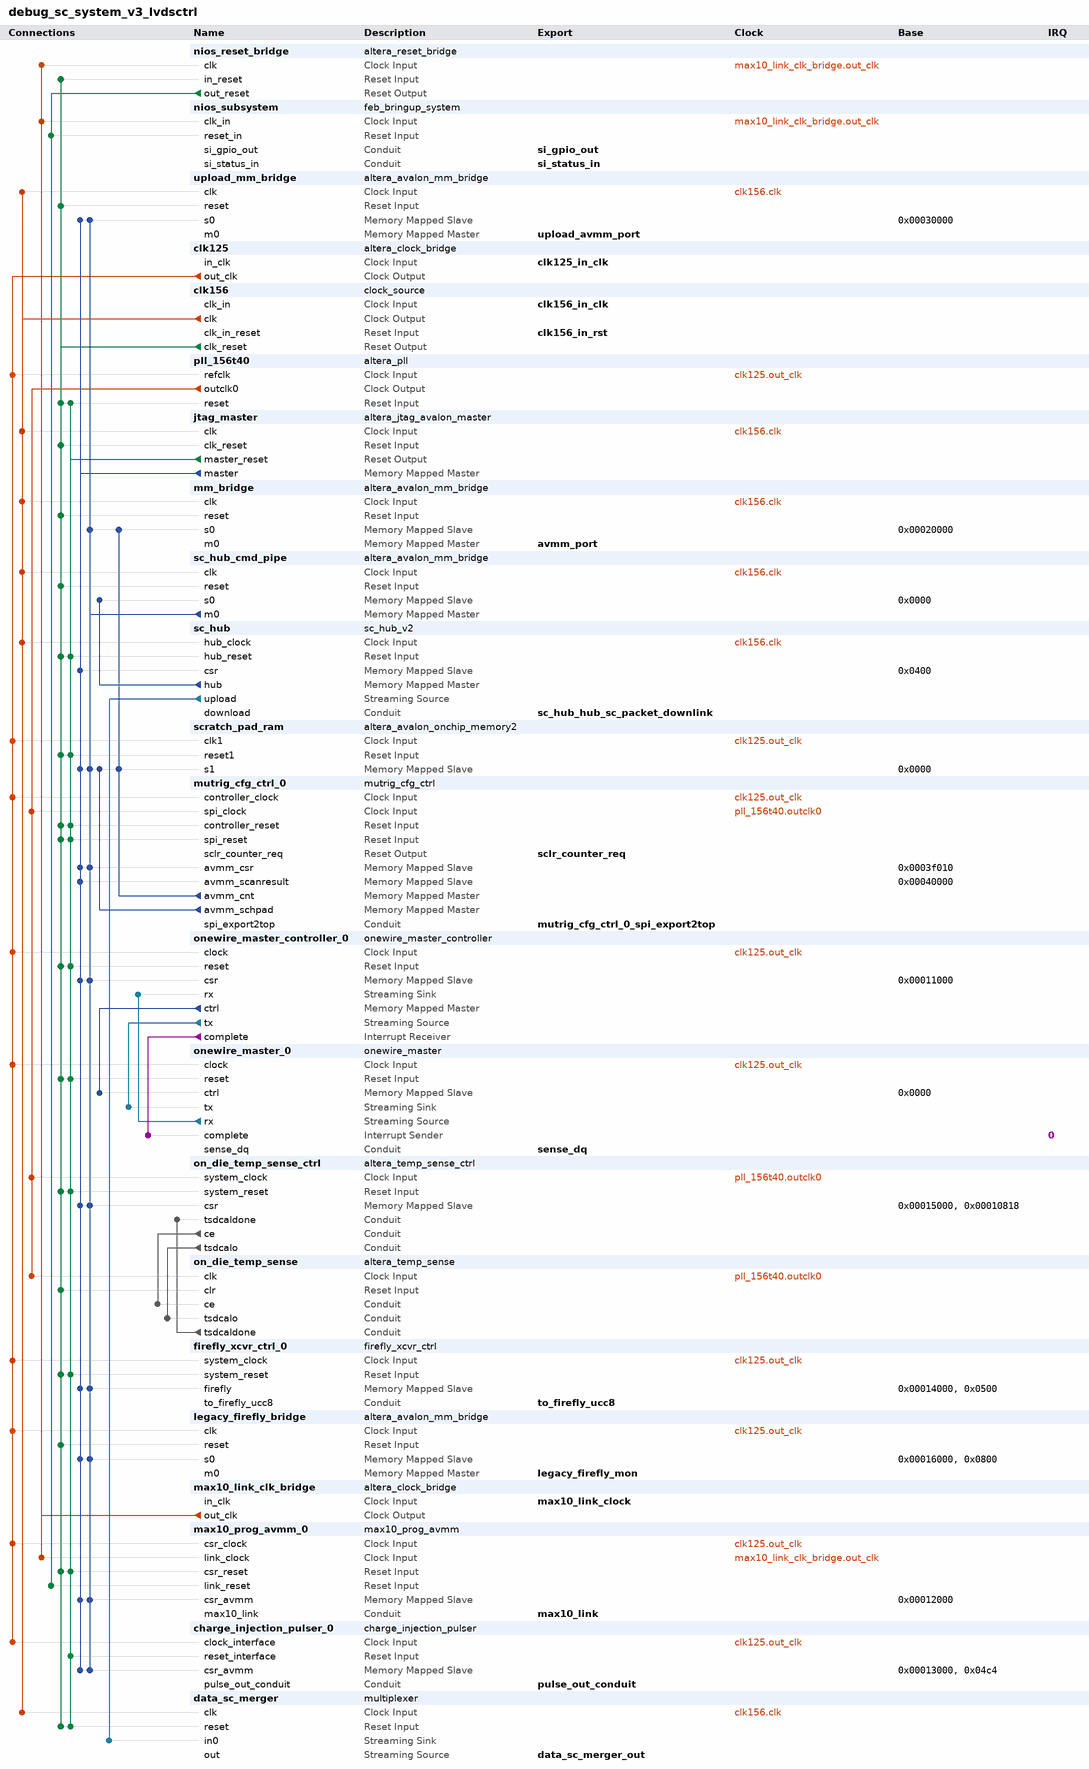
[diagram p0: system contents]
# Platform Designer (Qsys) system debug_sc_system_v3_lvdsctrl, Arria V 5AGXBA7D4F31C5
# Parameters at their usual value, and those the tool derives, are not listed.
package require -exact qsys 18.1
create_system debug_sc_system_v3_lvdsctrl
set_project_property DEVICE_FAMILY {Arria V}
set_project_property DEVICE 5AGXBA7D4F31C5

add_instance nios_reset_bridge altera_reset_bridge 18.1
set_instance_parameter_value nios_reset_bridge ACTIVE_LOW_RESET 0
set_instance_parameter_value nios_reset_bridge SYNCHRONOUS_EDGES deassert

add_instance nios_subsystem feb_bringup_system 1.0

add_instance upload_mm_bridge altera_avalon_mm_bridge 18.1
set_instance_parameter_value upload_mm_bridge ADDRESS_UNITS WORDS
set_instance_parameter_value upload_mm_bridge ADDRESS_WIDTH 5
set_instance_parameter_value upload_mm_bridge DATA_WIDTH 32
set_instance_parameter_value upload_mm_bridge MAX_PENDING_RESPONSES 4
set_instance_parameter_value upload_mm_bridge PIPELINE_COMMAND 0
set_instance_parameter_value upload_mm_bridge USE_AUTO_ADDRESS_WIDTH 0
set_instance_parameter_value upload_mm_bridge USE_RESPONSE 1

add_instance clk125 altera_clock_bridge 18.1
set_instance_parameter_value clk125 DERIVED_CLOCK_RATE 0
set_instance_parameter_value clk125 EXPLICIT_CLOCK_RATE 125000000

add_instance clk156 clock_source 18.1
set_instance_parameter_value clk156 clockFrequency 156250000
set_instance_parameter_value clk156 resetSynchronousEdges DEASSERT

add_instance pll_156t40 altera_pll 18.1
set_instance_parameter_value pll_156t40 gui_device_speed_grade 1
set_instance_parameter_value pll_156t40 gui_number_of_clocks 1
set_instance_parameter_value pll_156t40 gui_operation_mode direct
set_instance_parameter_value pll_156t40 gui_output_clock_frequency0 40.0
set_instance_parameter_value pll_156t40 gui_pll_mode {Integer-N PLL}
set_instance_parameter_value pll_156t40 gui_reference_clock_frequency 125.0
set_instance_parameter_value pll_156t40 gui_use_locked true

add_instance jtag_master altera_jtag_avalon_master 18.1
set_instance_parameter_value jtag_master FAST_VER 1

add_instance mm_bridge altera_avalon_mm_bridge 18.1
set_instance_parameter_value mm_bridge ADDRESS_UNITS WORDS
set_instance_parameter_value mm_bridge ADDRESS_WIDTH 14
set_instance_parameter_value mm_bridge DATA_WIDTH 32
set_instance_parameter_value mm_bridge MAX_PENDING_RESPONSES 1
set_instance_parameter_value mm_bridge USE_AUTO_ADDRESS_WIDTH 1
set_instance_parameter_value mm_bridge USE_RESPONSE 1

add_instance sc_hub_cmd_pipe altera_avalon_mm_bridge 18.1
set_instance_parameter_value sc_hub_cmd_pipe ADDRESS_UNITS WORDS
set_instance_parameter_value sc_hub_cmd_pipe ADDRESS_WIDTH 18
set_instance_parameter_value sc_hub_cmd_pipe DATA_WIDTH 32
set_instance_parameter_value sc_hub_cmd_pipe MAX_PENDING_RESPONSES 1
set_instance_parameter_value sc_hub_cmd_pipe PIPELINE_COMMAND 0
set_instance_parameter_value sc_hub_cmd_pipe PIPELINE_RESPONSE 0
set_instance_parameter_value sc_hub_cmd_pipe USE_AUTO_ADDRESS_WIDTH 1
set_instance_parameter_value sc_hub_cmd_pipe USE_RESPONSE 1

add_instance sc_hub sc_hub_v2 26.6.10.423
set_instance_parameter_value sc_hub ADDR_WIDTH 18
set_instance_parameter_value sc_hub ATOMIC_ENABLE true
set_instance_parameter_value sc_hub AXI4_ID_WIDTH 4
set_instance_parameter_value sc_hub AXI4_USER_WIDTH 16
set_instance_parameter_value sc_hub BACKPRESSURE true
set_instance_parameter_value sc_hub BP_FIFO_DEPTH 512
set_instance_parameter_value sc_hub BUILD 414
set_instance_parameter_value sc_hub BUS_TYPE AVALON
set_instance_parameter_value sc_hub DATA_WIDTH 32
set_instance_parameter_value sc_hub DEBUG 1
set_instance_parameter_value sc_hub EXT_DOWN_PLD_DEPTH 512
set_instance_parameter_value sc_hub EXT_UP_PLD_DEPTH 512
set_instance_parameter_value sc_hub GIT_STAMP_OVERRIDE false
set_instance_parameter_value sc_hub HUB_CAP_ENABLE true
set_instance_parameter_value sc_hub INSTANCE_ID 0
set_instance_parameter_value sc_hub INT_DOWN_PLD_DEPTH 64
set_instance_parameter_value sc_hub INT_HDR_DEPTH 4
set_instance_parameter_value sc_hub INT_UP_PLD_DEPTH 64
set_instance_parameter_value sc_hub INVERT_RD_SIG false
set_instance_parameter_value sc_hub IP_UID 1396918338
set_instance_parameter_value sc_hub MAX_BURST 256
set_instance_parameter_value sc_hub OOO_ENABLE false
set_instance_parameter_value sc_hub ORD_ENABLE true
set_instance_parameter_value sc_hub ORD_NUM_DOMAINS 16
set_instance_parameter_value sc_hub OUTSTANDING_INT_RESERVED 2
set_instance_parameter_value sc_hub OUTSTANDING_LIMIT 8
set_instance_parameter_value sc_hub PRESET FEB_SCIFI_DEFAULT
set_instance_parameter_value sc_hub RD_TIMEOUT_CYCLES 1024
set_instance_parameter_value sc_hub SCHEDULER_USE_PKT_TRANSFER true
set_instance_parameter_value sc_hub S_AND_F_ENABLE true
set_instance_parameter_value sc_hub VERSION_DATE 20260414
set_instance_parameter_value sc_hub VERSION_GIT 98822845
set_instance_parameter_value sc_hub VERSION_MAJOR 26
set_instance_parameter_value sc_hub VERSION_MINOR 6
set_instance_parameter_value sc_hub VERSION_PATCH 9
set_instance_parameter_value sc_hub WR_TIMEOUT_CYCLES 1024

add_instance scratch_pad_ram altera_avalon_onchip_memory2 18.1
set_instance_parameter_value scratch_pad_ram allowInSystemMemoryContentEditor true
set_instance_parameter_value scratch_pad_ram blockType M10K
set_instance_parameter_value scratch_pad_ram dataWidth 32
set_instance_parameter_value scratch_pad_ram dualPort false
set_instance_parameter_value scratch_pad_ram initMemContent true
set_instance_parameter_value scratch_pad_ram initializationFileName onchip_mem.hex
set_instance_parameter_value scratch_pad_ram instanceID 1
set_instance_parameter_value scratch_pad_ram memorySize 1024

add_instance mutrig_cfg_ctrl_0 mutrig_cfg_ctrl 24.1.423
set_instance_parameter_value mutrig_cfg_ctrl_0 CLK_FREQUENCY 125000000
set_instance_parameter_value mutrig_cfg_ctrl_0 CLK_FREQUENCY_SPI 40000000
set_instance_parameter_value mutrig_cfg_ctrl_0 COUNTER_MM_ADDR_OFFSET_WORD 32768
set_instance_parameter_value mutrig_cfg_ctrl_0 CPHA 0
set_instance_parameter_value mutrig_cfg_ctrl_0 CPOL 0
set_instance_parameter_value mutrig_cfg_ctrl_0 DEBUG 1
set_instance_parameter_value mutrig_cfg_ctrl_0 INTENDED_MUTRIG_VERSION {MuTRiG 3}
set_instance_parameter_value mutrig_cfg_ctrl_0 N_MUTRIG 4
set_instance_parameter_value mutrig_cfg_ctrl_0 SEL_SUBROUTINES 2

add_instance onewire_master_controller_0 onewire_master_controller 24.1.423
set_instance_parameter_value onewire_master_controller_0 AVMM_DATA_WIDTH 32
set_instance_parameter_value onewire_master_controller_0 AVST_CHANNEL_WIDTH 3
set_instance_parameter_value onewire_master_controller_0 AVST_DATA_WIDTH 8
set_instance_parameter_value onewire_master_controller_0 DEBUG_LV 0
set_instance_parameter_value onewire_master_controller_0 N_DQ_LINES 6
set_instance_parameter_value onewire_master_controller_0 REF_CLOCK_RATE 125000000
set_instance_parameter_value onewire_master_controller_0 SENSOR_TYPE DS18B20

add_instance onewire_master_0 onewire_master 24.1.423
set_instance_parameter_value onewire_master_0 AVMM_DATA_WIDTH 32
set_instance_parameter_value onewire_master_0 AVST_CHANNEL_WIDTH 3
set_instance_parameter_value onewire_master_0 AVST_DATA_WIDTH 8
set_instance_parameter_value onewire_master_0 DEBUG_LV 0
set_instance_parameter_value onewire_master_0 EN_STREAMING true
set_instance_parameter_value onewire_master_0 MASTER_INIT_RESET_US 500
set_instance_parameter_value onewire_master_0 MASTER_SAMPLE_PRESENCE_TIMEOUT_US 1000
set_instance_parameter_value onewire_master_0 MASTER_WAIT_PRESENCE_US 45
set_instance_parameter_value onewire_master_0 N_DQ_LINES 6
set_instance_parameter_value onewire_master_0 PARACITIC_POWERING false
set_instance_parameter_value onewire_master_0 REF_CLOCK_RATE 125000000
set_instance_parameter_value onewire_master_0 RX_BUFFER_DEPTH 16
set_instance_parameter_value onewire_master_0 RX_MASTER_SAMPLE_US 10
set_instance_parameter_value onewire_master_0 RX_PULL_LOW_US 5
set_instance_parameter_value onewire_master_0 RX_SLOT_US 90
set_instance_parameter_value onewire_master_0 SLOTS_SEPERATION_US 5
set_instance_parameter_value onewire_master_0 TX_BUFFER_DEPTH 8
set_instance_parameter_value onewire_master_0 TX_PULL_LOW_US 5
set_instance_parameter_value onewire_master_0 TX_SLOT_US 90
set_instance_parameter_value onewire_master_0 USE_IRQ true
set_instance_parameter_value onewire_master_0 VARIANT lite

add_instance on_die_temp_sense_ctrl altera_temp_sense_ctrl 1.1
set_instance_parameter_value on_die_temp_sense_ctrl CLK_FREQ 40000000
set_instance_parameter_value on_die_temp_sense_ctrl DEBUG 0

add_instance on_die_temp_sense altera_temp_sense 18.1
set_instance_parameter_value on_die_temp_sense CBX_AUTO_BLACKBOX ALL
set_instance_parameter_value on_die_temp_sense CE_CHECK true
set_instance_parameter_value on_die_temp_sense CLK_FREQUENCY 40.0
set_instance_parameter_value on_die_temp_sense CLOCK_DIVIDER_VALUE 80
set_instance_parameter_value on_die_temp_sense CLR_CHECK true
set_instance_parameter_value on_die_temp_sense NUMBER_OF_SAMPLES 128
set_instance_parameter_value on_die_temp_sense POI_CAL_TEMPERATURE 85
set_instance_parameter_value on_die_temp_sense SIM_TSDCALO 0
set_instance_parameter_value on_die_temp_sense USER_OFFSET_ENABLE off
set_instance_parameter_value on_die_temp_sense USE_WYS on

add_instance firefly_xcvr_ctrl_0 firefly_xcvr_ctrl 26.2.423
set_instance_parameter_value firefly_xcvr_ctrl_0 AVS_FIREFLY_ADDR_W 5
set_instance_parameter_value firefly_xcvr_ctrl_0 DEBUG 1
set_instance_parameter_value firefly_xcvr_ctrl_0 I2C_BAUD_RATE 400000
set_instance_parameter_value firefly_xcvr_ctrl_0 SYSTEM_CLK_FREQ 125000000

add_instance legacy_firefly_bridge altera_avalon_mm_bridge 18.1
set_instance_parameter_value legacy_firefly_bridge ADDRESS_UNITS WORDS
set_instance_parameter_value legacy_firefly_bridge ADDRESS_WIDTH 8
set_instance_parameter_value legacy_firefly_bridge DATA_WIDTH 32
set_instance_parameter_value legacy_firefly_bridge MAX_PENDING_RESPONSES 1
set_instance_parameter_value legacy_firefly_bridge PIPELINE_RESPONSE 0
set_instance_parameter_value legacy_firefly_bridge USE_AUTO_ADDRESS_WIDTH 0
set_instance_parameter_value legacy_firefly_bridge USE_RESPONSE 1

add_instance max10_link_clk_bridge altera_clock_bridge 18.1
set_instance_parameter_value max10_link_clk_bridge DERIVED_CLOCK_RATE 0
set_instance_parameter_value max10_link_clk_bridge EXPLICIT_CLOCK_RATE 50000000

add_instance max10_prog_avmm_0 max10_prog_avmm 0.2.0
set_instance_parameter_value max10_prog_avmm_0 BOOT_HIST_AUTO_REFRESH 1
set_instance_parameter_value max10_prog_avmm_0 BUILD 0
set_instance_parameter_value max10_prog_avmm_0 BURSTCOUNT_W 1
set_instance_parameter_value max10_prog_avmm_0 CDC_FIFO_ADDR_W 7
set_instance_parameter_value max10_prog_avmm_0 CSR_ADDR_W 10
set_instance_parameter_value max10_prog_avmm_0 DEBUG_LEVEL 0
set_instance_parameter_value max10_prog_avmm_0 IP_ID 1295067216
set_instance_parameter_value max10_prog_avmm_0 VERSION_MAJOR 0
set_instance_parameter_value max10_prog_avmm_0 VERSION_MINOR 2
set_instance_parameter_value max10_prog_avmm_0 VERSION_PATCH 0

add_instance charge_injection_pulser_0 charge_injection_pulser 4.0.5
set_instance_parameter_value charge_injection_pulser_0 CLK_FREQUENCY 125000000
set_instance_parameter_value charge_injection_pulser_0 DEBUG 1
set_instance_parameter_value charge_injection_pulser_0 DEF_PULSE_FREQ 100000
set_instance_parameter_value charge_injection_pulser_0 DEF_PULSE_WIDTH 20

add_instance data_sc_merger multiplexer 18.1
set_instance_parameter_value data_sc_merger bitsPerSymbol 36
set_instance_parameter_value data_sc_merger errorWidth 0
set_instance_parameter_value data_sc_merger numInputInterfaces 2
set_instance_parameter_value data_sc_merger outChannelWidth 1
set_instance_parameter_value data_sc_merger packetScheduling true
set_instance_parameter_value data_sc_merger schedulingSize 2
set_instance_parameter_value data_sc_merger symbolsPerBeat 1
set_instance_parameter_value data_sc_merger useHighBitsOfChannel true
set_instance_parameter_value data_sc_merger usePackets true

# connections
add_connection clk125.out_clk charge_injection_pulser_0.clock_interface clock
add_connection clk125.out_clk firefly_xcvr_ctrl_0.system_clock clock
add_connection clk125.out_clk legacy_firefly_bridge.clk clock
add_connection clk125.out_clk max10_prog_avmm_0.csr_clock clock
add_connection clk125.out_clk mutrig_cfg_ctrl_0.controller_clock clock
add_connection clk125.out_clk onewire_master_0.clock clock
add_connection clk125.out_clk onewire_master_controller_0.clock clock
add_connection clk125.out_clk pll_156t40.refclk clock
add_connection clk125.out_clk scratch_pad_ram.clk1 clock
add_connection clk156.clk data_sc_merger.clk clock
add_connection clk156.clk jtag_master.clk clock
add_connection clk156.clk mm_bridge.clk clock
add_connection clk156.clk sc_hub.hub_clock clock
add_connection clk156.clk sc_hub_cmd_pipe.clk clock
add_connection clk156.clk upload_mm_bridge.clk clock
add_connection max10_link_clk_bridge.out_clk max10_prog_avmm_0.link_clock clock
add_connection max10_link_clk_bridge.out_clk nios_reset_bridge.clk clock
add_connection max10_link_clk_bridge.out_clk nios_subsystem.clk_in clock
add_connection pll_156t40.outclk0 mutrig_cfg_ctrl_0.spi_clock clock
add_connection pll_156t40.outclk0 on_die_temp_sense.clk clock
add_connection pll_156t40.outclk0 on_die_temp_sense_ctrl.system_clock clock
add_connection clk156.clk_reset data_sc_merger.reset reset
add_connection clk156.clk_reset firefly_xcvr_ctrl_0.system_reset reset
add_connection clk156.clk_reset jtag_master.clk_reset reset
add_connection clk156.clk_reset legacy_firefly_bridge.reset reset
add_connection clk156.clk_reset max10_prog_avmm_0.csr_reset reset
add_connection clk156.clk_reset mm_bridge.reset reset
add_connection clk156.clk_reset mutrig_cfg_ctrl_0.controller_reset reset
add_connection clk156.clk_reset mutrig_cfg_ctrl_0.spi_reset reset
add_connection clk156.clk_reset nios_reset_bridge.in_reset reset
add_connection clk156.clk_reset on_die_temp_sense.clr reset
add_connection clk156.clk_reset on_die_temp_sense_ctrl.system_reset reset
add_connection clk156.clk_reset onewire_master_0.reset reset
add_connection clk156.clk_reset onewire_master_controller_0.reset reset
add_connection clk156.clk_reset pll_156t40.reset reset
add_connection clk156.clk_reset sc_hub.hub_reset reset
add_connection clk156.clk_reset sc_hub_cmd_pipe.reset reset
add_connection clk156.clk_reset scratch_pad_ram.reset1 reset
add_connection clk156.clk_reset upload_mm_bridge.reset reset
add_connection jtag_master.master_reset charge_injection_pulser_0.reset_interface reset
add_connection jtag_master.master_reset data_sc_merger.reset reset
add_connection jtag_master.master_reset firefly_xcvr_ctrl_0.system_reset reset
add_connection jtag_master.master_reset max10_prog_avmm_0.csr_reset reset
add_connection jtag_master.master_reset mutrig_cfg_ctrl_0.controller_reset reset
add_connection jtag_master.master_reset mutrig_cfg_ctrl_0.spi_reset reset
add_connection jtag_master.master_reset on_die_temp_sense_ctrl.system_reset reset
add_connection jtag_master.master_reset onewire_master_0.reset reset
add_connection jtag_master.master_reset onewire_master_controller_0.reset reset
add_connection jtag_master.master_reset pll_156t40.reset reset
add_connection jtag_master.master_reset sc_hub.hub_reset reset
add_connection jtag_master.master_reset scratch_pad_ram.reset1 reset
add_connection nios_reset_bridge.out_reset max10_prog_avmm_0.link_reset reset
add_connection nios_reset_bridge.out_reset nios_subsystem.reset_in reset
add_connection jtag_master.master charge_injection_pulser_0.csr_avmm avalon
set_connection_parameter_value jtag_master.master/charge_injection_pulser_0.csr_avmm baseAddress 0x04c4
add_connection jtag_master.master firefly_xcvr_ctrl_0.firefly avalon
set_connection_parameter_value jtag_master.master/firefly_xcvr_ctrl_0.firefly baseAddress 0x0500
add_connection jtag_master.master legacy_firefly_bridge.s0 avalon
set_connection_parameter_value jtag_master.master/legacy_firefly_bridge.s0 baseAddress 0x0800
add_connection jtag_master.master max10_prog_avmm_0.csr_avmm avalon
set_connection_parameter_value jtag_master.master/max10_prog_avmm_0.csr_avmm baseAddress 0x00012000
add_connection jtag_master.master mutrig_cfg_ctrl_0.avmm_csr avalon
set_connection_parameter_value jtag_master.master/mutrig_cfg_ctrl_0.avmm_csr baseAddress 0x0003f010
add_connection jtag_master.master mutrig_cfg_ctrl_0.avmm_scanresult avalon
set_connection_parameter_value jtag_master.master/mutrig_cfg_ctrl_0.avmm_scanresult baseAddress 0x00040000
add_connection jtag_master.master on_die_temp_sense_ctrl.csr avalon
set_connection_parameter_value jtag_master.master/on_die_temp_sense_ctrl.csr baseAddress 0x00010818
add_connection jtag_master.master onewire_master_controller_0.csr avalon
set_connection_parameter_value jtag_master.master/onewire_master_controller_0.csr baseAddress 0x00011000
add_connection jtag_master.master sc_hub.csr avalon
set_connection_parameter_value jtag_master.master/sc_hub.csr baseAddress 0x0400
add_connection jtag_master.master scratch_pad_ram.s1 avalon
set_connection_parameter_value jtag_master.master/scratch_pad_ram.s1 arbitrationPriority 3
set_connection_parameter_value jtag_master.master/scratch_pad_ram.s1 baseAddress 0x0000
add_connection jtag_master.master upload_mm_bridge.s0 avalon
set_connection_parameter_value jtag_master.master/upload_mm_bridge.s0 baseAddress 0x00030000
add_connection mutrig_cfg_ctrl_0.avmm_cnt mm_bridge.s0 avalon
set_connection_parameter_value mutrig_cfg_ctrl_0.avmm_cnt/mm_bridge.s0 baseAddress 0x00020000
add_connection mutrig_cfg_ctrl_0.avmm_cnt scratch_pad_ram.s1 avalon
set_connection_parameter_value mutrig_cfg_ctrl_0.avmm_cnt/scratch_pad_ram.s1 baseAddress 0x0000
add_connection mutrig_cfg_ctrl_0.avmm_schpad scratch_pad_ram.s1 avalon
set_connection_parameter_value mutrig_cfg_ctrl_0.avmm_schpad/scratch_pad_ram.s1 arbitrationPriority 2
set_connection_parameter_value mutrig_cfg_ctrl_0.avmm_schpad/scratch_pad_ram.s1 baseAddress 0x0000
add_connection onewire_master_controller_0.ctrl onewire_master_0.ctrl avalon
set_connection_parameter_value onewire_master_controller_0.ctrl/onewire_master_0.ctrl baseAddress 0x0000
add_connection sc_hub.hub sc_hub_cmd_pipe.s0 avalon
set_connection_parameter_value sc_hub.hub/sc_hub_cmd_pipe.s0 baseAddress 0x0000
add_connection sc_hub_cmd_pipe.m0 charge_injection_pulser_0.csr_avmm avalon
set_connection_parameter_value sc_hub_cmd_pipe.m0/charge_injection_pulser_0.csr_avmm baseAddress 0x00013000
add_connection sc_hub_cmd_pipe.m0 firefly_xcvr_ctrl_0.firefly avalon
set_connection_parameter_value sc_hub_cmd_pipe.m0/firefly_xcvr_ctrl_0.firefly baseAddress 0x00014000
add_connection sc_hub_cmd_pipe.m0 legacy_firefly_bridge.s0 avalon
set_connection_parameter_value sc_hub_cmd_pipe.m0/legacy_firefly_bridge.s0 baseAddress 0x00016000
add_connection sc_hub_cmd_pipe.m0 max10_prog_avmm_0.csr_avmm avalon
set_connection_parameter_value sc_hub_cmd_pipe.m0/max10_prog_avmm_0.csr_avmm baseAddress 0x00012000
add_connection sc_hub_cmd_pipe.m0 mm_bridge.s0 avalon
set_connection_parameter_value sc_hub_cmd_pipe.m0/mm_bridge.s0 baseAddress 0x00020000
add_connection sc_hub_cmd_pipe.m0 mutrig_cfg_ctrl_0.avmm_csr avalon
set_connection_parameter_value sc_hub_cmd_pipe.m0/mutrig_cfg_ctrl_0.avmm_csr baseAddress 0x0003f010
add_connection sc_hub_cmd_pipe.m0 on_die_temp_sense_ctrl.csr avalon
set_connection_parameter_value sc_hub_cmd_pipe.m0/on_die_temp_sense_ctrl.csr baseAddress 0x00015000
add_connection sc_hub_cmd_pipe.m0 onewire_master_controller_0.csr avalon
set_connection_parameter_value sc_hub_cmd_pipe.m0/onewire_master_controller_0.csr baseAddress 0x00011000
add_connection sc_hub_cmd_pipe.m0 scratch_pad_ram.s1 avalon
set_connection_parameter_value sc_hub_cmd_pipe.m0/scratch_pad_ram.s1 baseAddress 0x0000
add_connection sc_hub_cmd_pipe.m0 upload_mm_bridge.s0 avalon
set_connection_parameter_value sc_hub_cmd_pipe.m0/upload_mm_bridge.s0 baseAddress 0x00030000
add_connection onewire_master_0.rx onewire_master_controller_0.rx avalon_streaming
add_connection onewire_master_controller_0.tx onewire_master_0.tx avalon_streaming
add_connection sc_hub.upload data_sc_merger.in0 avalon_streaming
add_connection on_die_temp_sense.tsdcaldone on_die_temp_sense_ctrl.tsdcaldone conduit
add_connection on_die_temp_sense_ctrl.ce on_die_temp_sense.ce conduit
add_connection on_die_temp_sense_ctrl.tsdcalo on_die_temp_sense.tsdcalo conduit
add_connection onewire_master_controller_0.complete onewire_master_0.complete interrupt
set_connection_parameter_value onewire_master_controller_0.complete/onewire_master_0.complete irqNumber 0

# exported interfaces
add_interface avmm_port avalon master
set_interface_property avmm_port EXPORT_OF mm_bridge.m0
add_interface clk125_in_clk clock sink
set_interface_property clk125_in_clk EXPORT_OF clk125.in_clk
add_interface clk156_in_clk clock sink
set_interface_property clk156_in_clk EXPORT_OF clk156.clk_in
add_interface clk156_in_rst reset sink
set_interface_property clk156_in_rst EXPORT_OF clk156.clk_in_reset
add_interface data_sc_merger_out avalon_streaming source
set_interface_property data_sc_merger_out EXPORT_OF data_sc_merger.out
add_interface legacy_firefly_mon avalon master
set_interface_property legacy_firefly_mon EXPORT_OF legacy_firefly_bridge.m0
add_interface max10_link conduit end
set_interface_property max10_link EXPORT_OF max10_prog_avmm_0.max10_link
add_interface max10_link_clock clock sink
set_interface_property max10_link_clock EXPORT_OF max10_link_clk_bridge.in_clk
add_interface mutrig_cfg_ctrl_0_spi_export2top conduit end
set_interface_property mutrig_cfg_ctrl_0_spi_export2top EXPORT_OF mutrig_cfg_ctrl_0.spi_export2top
add_interface pulse_out_conduit conduit end
set_interface_property pulse_out_conduit EXPORT_OF charge_injection_pulser_0.pulse_out_conduit
add_interface sc_hub_hub_sc_packet_downlink conduit end
set_interface_property sc_hub_hub_sc_packet_downlink EXPORT_OF sc_hub.download
add_interface sclr_counter_req reset source
set_interface_property sclr_counter_req EXPORT_OF mutrig_cfg_ctrl_0.sclr_counter_req
add_interface sense_dq conduit end
set_interface_property sense_dq EXPORT_OF onewire_master_0.sense_dq
add_interface si_gpio_out conduit end
set_interface_property si_gpio_out EXPORT_OF nios_subsystem.si_gpio_out
add_interface si_status_in conduit end
set_interface_property si_status_in EXPORT_OF nios_subsystem.si_status_in
add_interface to_firefly_ucc8 conduit end
set_interface_property to_firefly_ucc8 EXPORT_OF firefly_xcvr_ctrl_0.to_firefly_ucc8
add_interface upload_avmm_port avalon master
set_interface_property upload_avmm_port EXPORT_OF upload_mm_bridge.m0

set_interconnect_requirement {$system} qsys_mm.clockCrossingAdapter AUTO
set_interconnect_requirement {$system} qsys_mm.enableEccProtection FALSE
set_interconnect_requirement {$system} qsys_mm.enableInstrumentation FALSE
set_interconnect_requirement {$system} qsys_mm.insertDefaultSlave FALSE
set_interconnect_requirement {$system} qsys_mm.maxAdditionalLatency 4
set_interconnect_requirement jtag_master.master qsys_mm.security NON_SECURE
set_interconnect_requirement mutrig_cfg_ctrl_0.avmm_schpad qsys_mm.insertPerformanceMonitor FALSE
set_interconnect_requirement mutrig_spi_master.spi_control_port qsys_mm.security NON_SECURE
set_interconnect_requirement sc_hub.hub qsys_mm.insertPerformanceMonitor FALSE
set_interconnect_requirement sc_hub_cmd_pipe.m0 qsys_mm.constantBurstBehavior TRUE
set_interconnect_requirement scratch_pad_ram.s1 qsys_mm.insertPerformanceMonitor FALSE

save_system debug_sc_system_v3_lvdsctrl.qsys
